# EAGLE design PowerBoard-v1.2 (EAGLE 8.5.2)
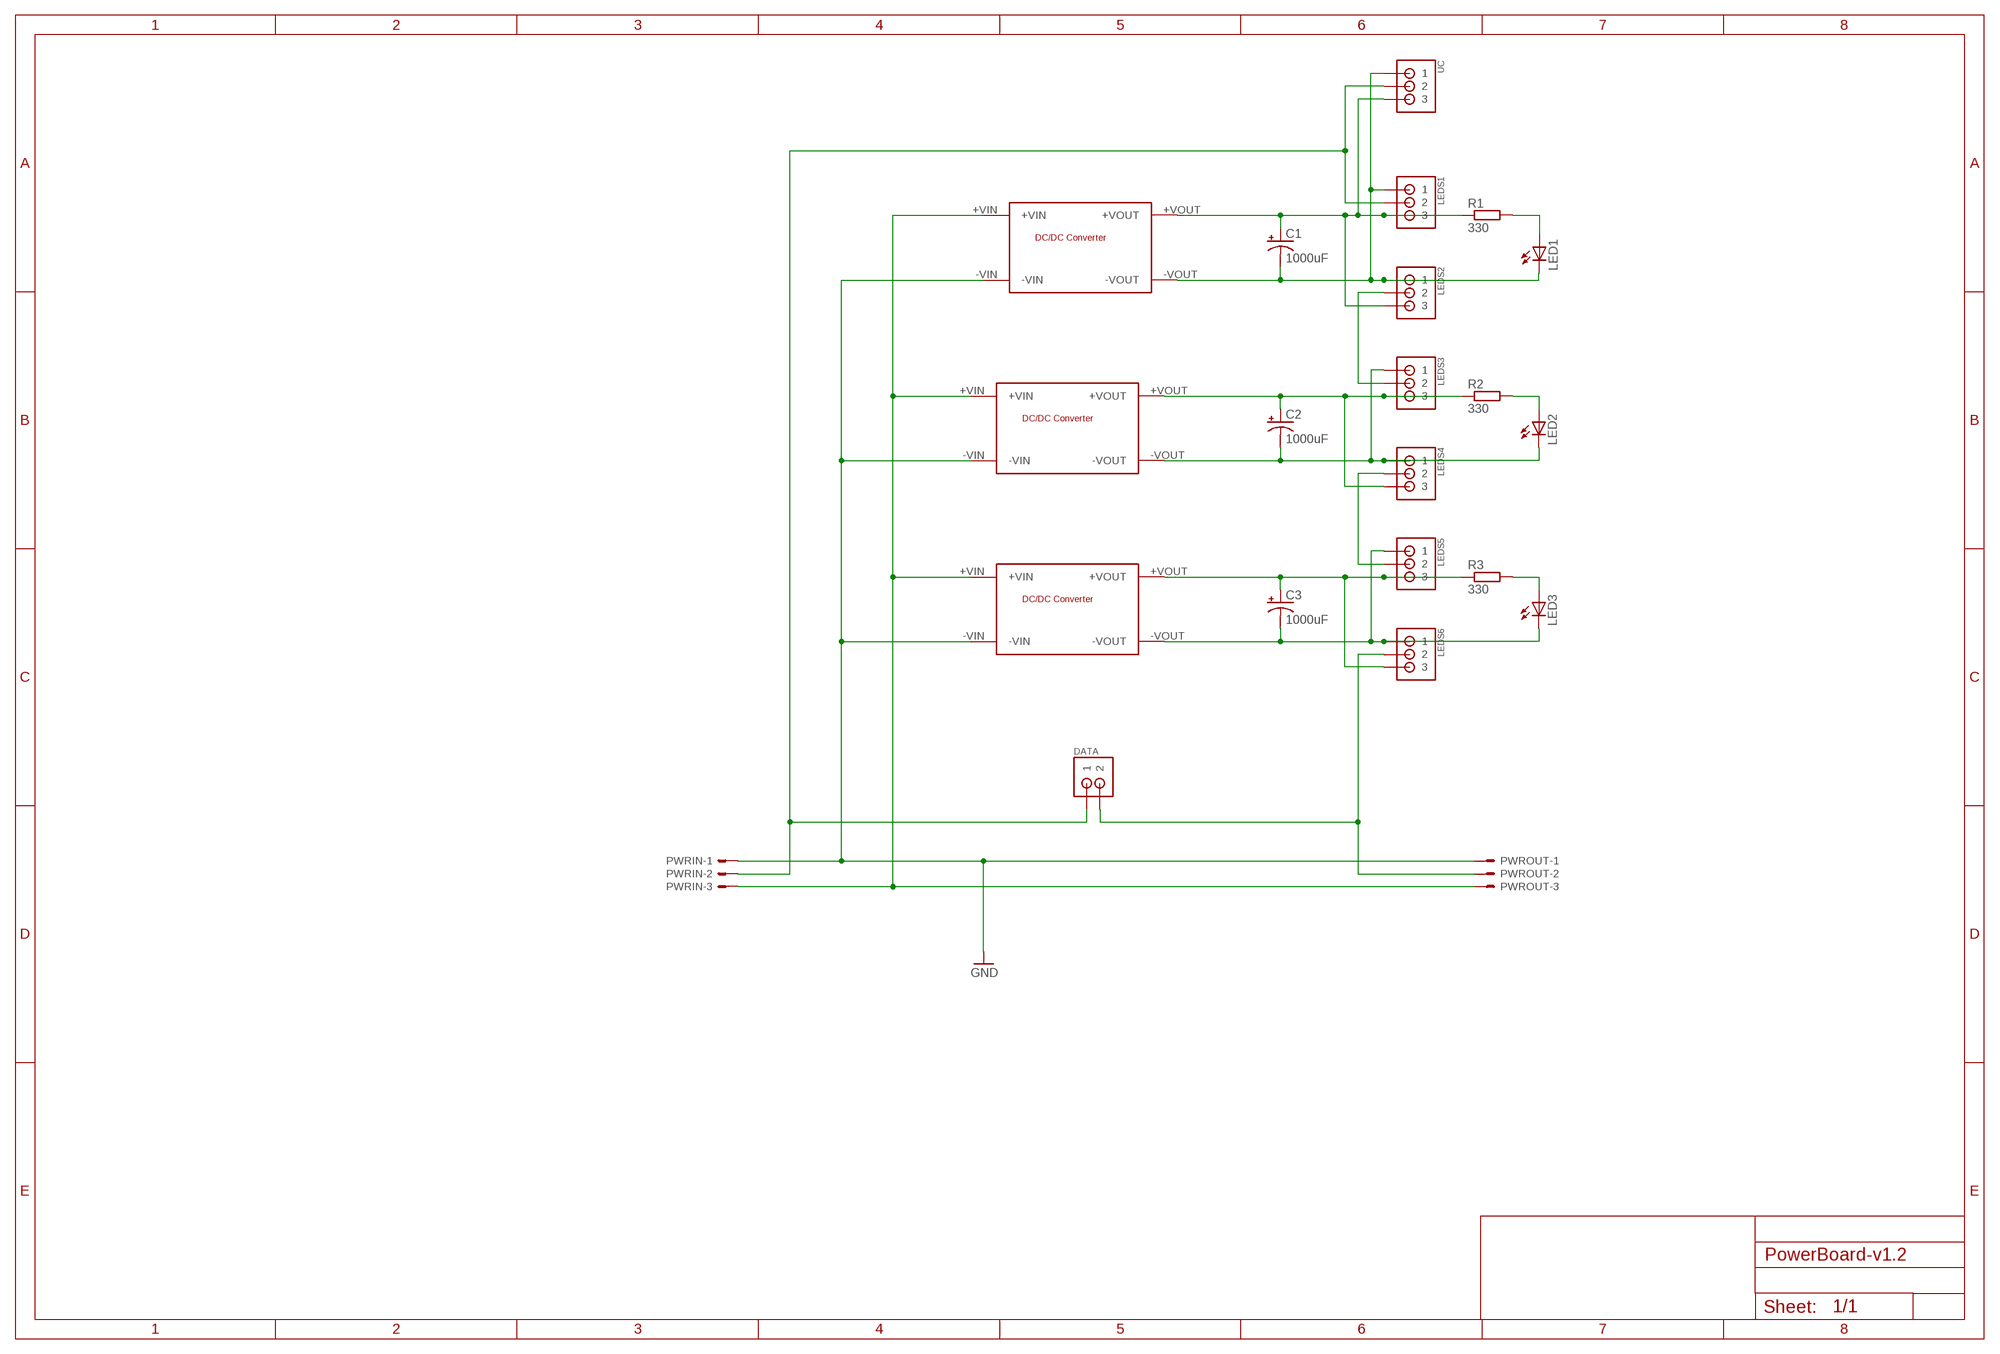
[diagram p0: schematic, sheet 1]

## Parts
C1  1000uF  CAP_POLPTH4  [CPOL-RADIAL-1000UF-25V]
C2  1000uF  CAP_POLPTH4  [CPOL-RADIAL-1000UF-25V]
C3  1000uF  CAP_POLPTH4  [CPOL-RADIAL-1000UF-25V]
DATA  JST-XA-02-PIN  [JST-XA-02]
LED1  LEDCHIP-LED0805  [CHIP-LED0805]
LED2  LEDCHIP-LED0805  [CHIP-LED0805]
LED3  LEDCHIP-LED0805  [CHIP-LED0805]
LEDS1  JST-XA-03-PIN  [JST-XA-03]
LEDS2  JST-XA-03-PIN  [JST-XA-03]
LEDS3  JST-XA-03-PIN  [JST-XA-03]
LEDS4  JST-XA-03-PIN  [JST-XA-03]
LEDS5  JST-XA-03-PIN  [JST-XA-03]
LEDS6  JST-XA-03-PIN  [JST-XA-03]
PWRIN  KK-156-3  [KK-156-3]
PWROUT  KK-156-3  [KK-156-3]
R1  330  RESISTORM0805  [M0805]
R2  330  RESISTORM0805  [M0805]
R3  330  RESISTORM0805  [M0805]
U$1  DC-DC-CONVERTER  [MP1584EN-BUCK-CONVERTER]
U$2  DC-DC-CONVERTER  [MP1584EN-BUCK-CONVERTER]
U$3  DC-DC-CONVERTER  [MP1584EN-BUCK-CONVERTER]
UC  JST-XA-03-PIN  [JST-XA-03]

## Nets
DATIN: DATA.1 LEDS1.2 PWRIN.2 UC.2
DATOUT: DATA.2 LEDS6.2 PWROUT.2
GND: PWRIN.1 PWROUT.1 U$1.-VIN U$2.-VIN U$3.-VIN
GNDOUT1: C1.- LED1.C LEDS1.1 LEDS2.1 U$1.-VOUT UC.1
GNDOUT2: C2.- LED2.C LEDS3.1 LEDS4.1 U$2.-VOUT
GNDOUT3: C3.- LED3.C LEDS5.1 LEDS6.1 U$3.-VOUT
N$2: LED1.A R1.2
N$7: LED2.A R2.2
N$11: LEDS2.2 LEDS3.2
N$12: LEDS4.2 LEDS5.2
N$15: LED3.A R3.2
VIN: PWRIN.3 PWROUT.3 U$1.+VIN U$2.+VIN U$3.+VIN
VOUT1: C1.+ LEDS1.3 LEDS2.3 R1.1 U$1.+VOUT UC.3
VOUT2: C2.+ LEDS3.3 LEDS4.3 R2.1 U$2.+VOUT
VOUT3: C3.+ LEDS5.3 LEDS6.3 R3.1 U$3.+VOUT

## Library data of the parts
C1-C3 = SparkFun-Capacitors:CAP_POL: Capacitor Polarized These are standard SMD and PTH capacitors. Normally 10uF, 47uF, and 100uF in electrolytic and tantalum varieties. Always verify the external diameter of the through hole cap, it varies with capacity, voltage, and manufacturer. The EIA devices should be standard.
DATA = abw:JST-XA-02-PIN: JST XA Connector 2 Pin Wire to board connector. Pitch: 2.54 mm, (0.100") Number of pins: 2
LED1-LED3 = adafruit:LED: LED OSRAM: - CHIPLED LG R971, LG N971, LY N971, LG Q971, LY Q971, LO R971, LY R971 LH N974, LH R974 LS Q976, LO Q976, LY Q976 LO Q996 - Hyper CHIPLED LW Q18S LB Q993, LB Q99A, LB R99A - SideLED LS A670, LO A670, LY A670, LG A670, LP A670 LB A673, LV A673, LT A673, LW A673 LH A674 LY A675 LS A676, LA A676, LO A676, LY A676, LW A676 LS A679, LY A679, LG A679 - Hyper Micro SIDELED® LS Y876, LA Y876, LO Y876, LY Y876 LT Y87S - SmartLED LW L88C, LW L88S LB L89C, LB L89S, LG L890 LS L89K, LO L89K, LY L89K LS L896, LA L896, LO L896, LY L896 - TOPLED LS T670, LO T670, LY T670, LG T670, LP T670 LSG T670, LSP T670, LSY T670, LOP T670, LYG T670 LG T671, LOG T671, LSG T671 LB T673, LV T673, LT T673, LW T673 LH T674 LS T676, LA T676, LO T676, LY T676, LB T676, LH T676, LSB T676, LW T676 LB T67C, LV T67C, LT T67C, LS T67K, LO T67K, LY T67K, LW E67C LS E67B, LA E67B, LO E67B, LY E67B, LB E67C, LV E67C, LT E67C LW T67C LS T679, LY T679, LG T679 LS T770, LO T770, LY T770, LG T770, LP T770 LB T773, LV T773, LT T773, LW T773 LH T774 LS E675, LA E675, LY E675, LS T675 LS T776, LA T776, LO T776, LY T776, LB T776 LHGB T686 LT T68C, LB T68C - Hyper Mini TOPLED® LB M676 - Mini TOPLED Santana® LG M470 LS M47K, LO M47K, LY M47K Source: http://www.osram.convergy.de/
LEDS1-LEDS6 UC = abw:JST-XA-03-PIN: JST XA Connector 3 Pin Wire to board connector. Pitch: 2.54 mm, (0.100") Number of pins: 3
PWRIN PWROUT = con-molex:KK-156-3: KK 156 HEADER Source: http://www.molex.com/pdm_docs/sd/026604100_sd.pdf; MF: MOLEX; OC_FARNELL: unknown; OC_NEWARK: unknown
R1-R3 = abw:RESISTOR: RESISTOR, European symbol
U$1-U$3 = abw:DC-DC-CONVERTER

## Board
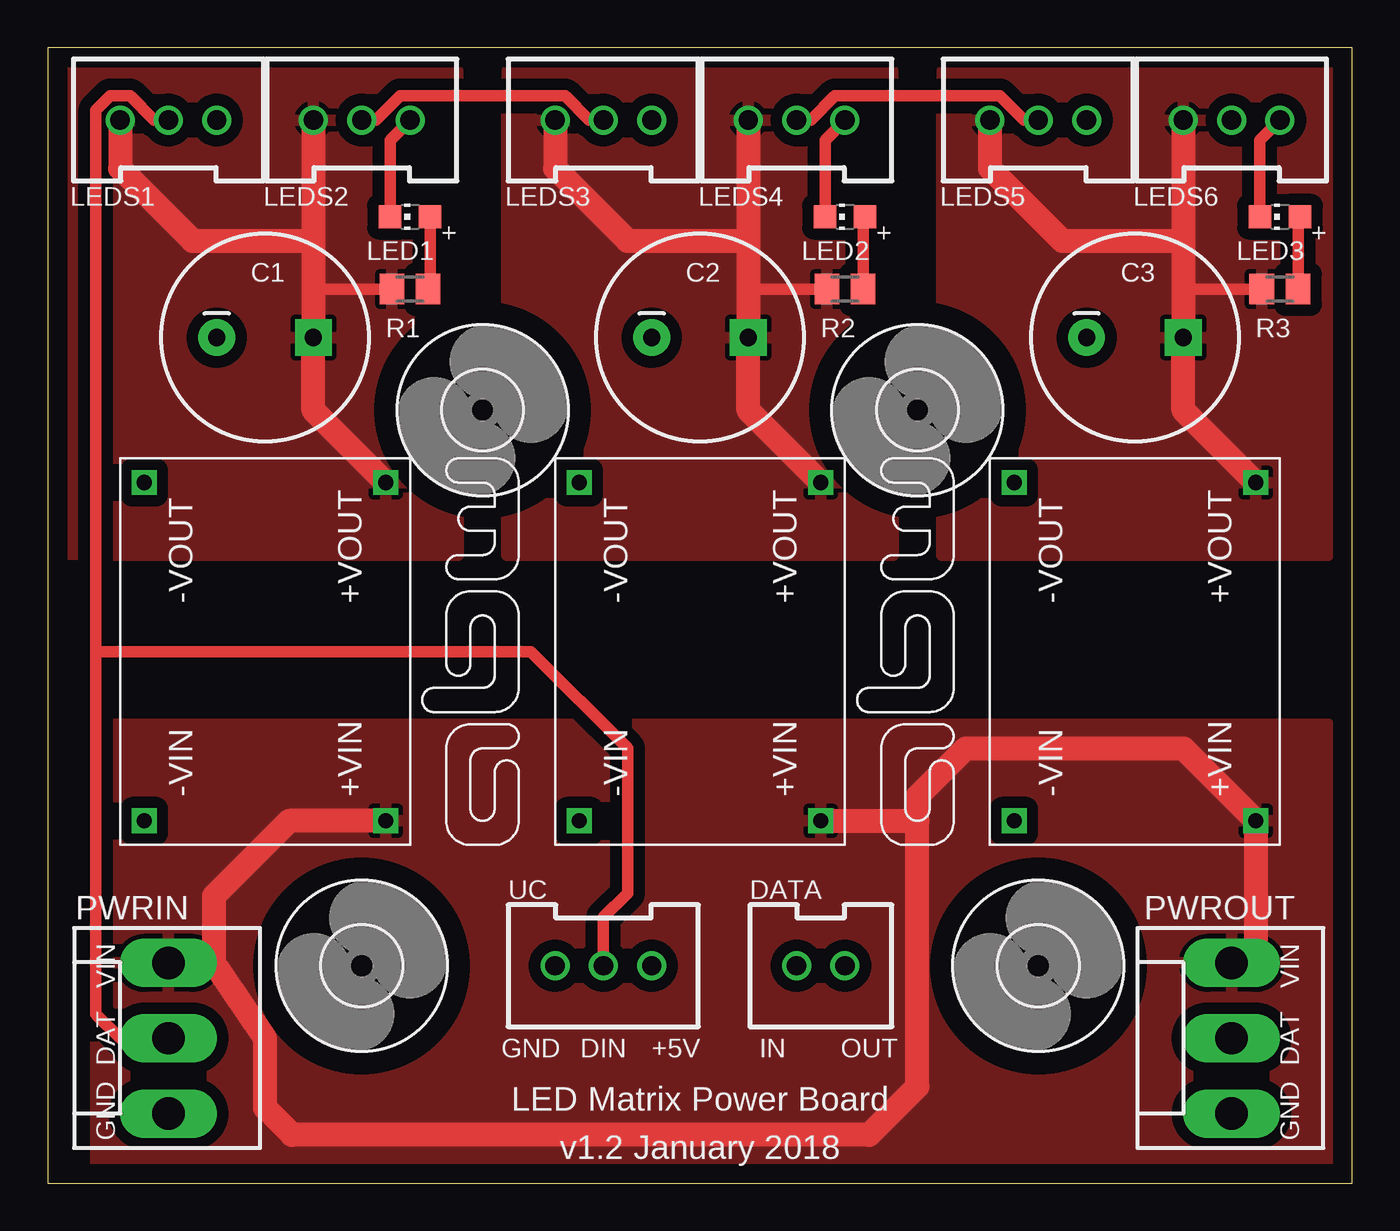
[diagram p1: board, top side]
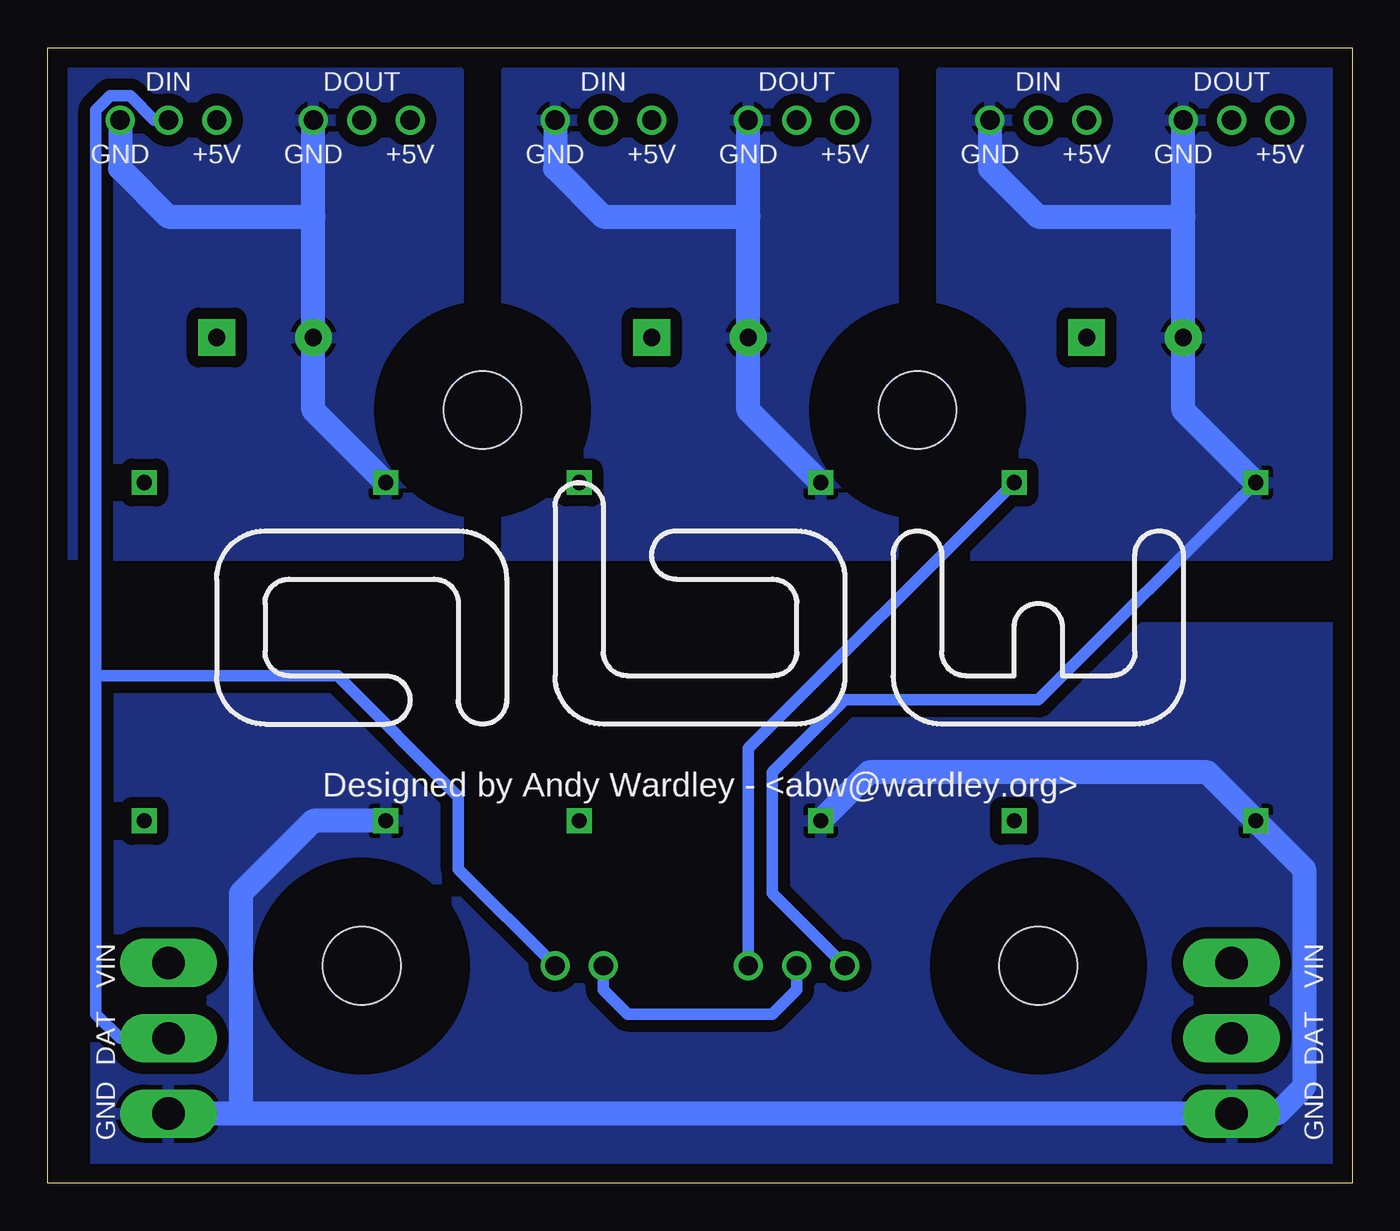
[diagram p2: board, bottom side, seen from below]

Size 68.58 x 59.69 mm. Coordinates in mm from the lower left corner, seen from the top.
Outline: 0,0 68.58,0 68.58,59.69 0,59.68 0,0
Copper layers (1*16): Top 0.035mm / dielectric 1.5mm / Bottom 0.035mm
Design rules "default": minimum track width 10mil, minimum drill 24mil, track to track 8mil, track to pad 8mil, pad to pad 8mil, via to via 8mil, smd to smd 8mil, copper to edge 40mil, drill to drill 8mil, minimum pad ring 10mil, minimum via ring 8mil, stop-mask expansion 4mil, vias tented up to drill 0mil, thermal gap 10mil

### Footprints (pad centres in the part's own frame; a part is rotated, then mirrored left to right if it is on the bottom)
CPOL-RADIAL-1000UF-25V = drill 0.9 pad 1.93 square: + 2.54,0 | drill 0.9 pad 1.93: - -2.54,0
JST-XA-02 = drill 1.016: 1 -2.54,0; 2 0,0
CHIP-LED0805 = smd 1.2 x 1.2: A 0,-1.05; C 0,1.05
JST-XA-03 = drill 1.016: 1 -2.54,0; 2 0,0; 3 2.54,0
KK-156-3 = drill 1.7 pad 2.184 long: 1 -3.96,0; 2 0,0; 3 3.96,0
M0805 = smd 1.3 x 1.6: 1 -0.95,0; 2 0.95,0
MP1584EN-BUCK-CONVERTER = drill 0.8 square: +VIN 0,0; +VOUT 17.78,0; -VIN 0,12.7; -VOUT 17.78,12.7
4,1 = hole 4.1: 0,0

### Placement (x,y rotation side)
C1  11.43,44.45 0 top
C2  34.29,44.45 0 top
C3  57.15,44.45 0 top
DATA  41.91,11.43 0 top
LED1  19.05,50.8 90 top
LED2  41.91,50.8 90 top
LED3  64.77,50.8 90 top
LEDS1  6.35,55.88 180 top
LEDS2  16.51,55.88 180 top
LEDS3  29.21,55.88 180 top
LEDS4  39.37,55.88 180 top
LEDS5  52.07,55.88 180 top
LEDS6  62.23,55.88 180 top
PWRIN  6.35,7.62 90 top
PWROUT  62.23,7.62 90 top
R1  19.05,46.99 0 top
R2  41.91,46.99 0 top
R3  64.77,46.99 0 top
U$1  17.78,19.05 90 top
U$2  40.64,19.05 90 top
U$3  63.5,19.05 90 top
U$4  [4,1]  16.51,11.43 0 top
U$5  [4,1]  22.86,40.64 0 top
U$6  [4,1]  52.07,11.43 0 top
U$7  [4,1]  45.72,40.64 0 top
U$8  [ABWLOGO-SMALL]  34.29,29.21 0 bottom
U$9  [ABWLOGO-MICRO]  22.86,27.94 90 top
U$10  [ABWLOGO-MICRO]  45.72,27.94 90 top
UC  29.21,11.43 0 top

### Tracks (layer width: path | path; a pad name or v marks a point on that pad's centre or on a via)
DATIN
  Top 0.61: LEDS1.2 5.61,55.88 4.34,57.15 3.28,57.15 2.54,56.41 2.54,27.94 | 2.54,27.94 2.54,8.89 3.81,7.62 PWRIN.2 | UC.2 29.21,13.97 30.48,15.24 30.48,22.86 25.4,27.94 2.54,27.94
  Bottom 0.61: DATA.1 39.37,10.16 38.1,8.89 30.48,8.89 29.21,10.16 UC.2
DATOUT
  Bottom 0.61: LEDS6.2 62.97,55.88 64.24,57.15 65.3,57.15 66.04,56.41 66.04,26.67 | 66.04,26.67 66.04,8.89 64.77,7.62 PWROUT.2 | DATA.2 46.99,16.51 46.99,20.32 53.34,26.67 66.04,26.67
GND
  Bottom 1.27: U$2.-VIN 25.4,21.59 7.62,21.59 U$1.-VIN 2.54,16.51 2.54,5.08 3.96,3.66 PWRIN.1 58.42,3.66 | U$3.-VIN 54.61,19.05 58.42,15.24 58.42,3.66 | 58.42,3.66 PWROUT.1
  pour Bottom (isolate 0.61): 0,29.21 66.04,29.21 66.04,0 0,0
GNDOUT1
  Top 0.61: LED1.C 18,54.83 LEDS2.1
  Bottom 0.61: U$1.-VOUT 16.51,25.4 26.67,25.4 30.48,21.59 30.48,15.24 UC.1
  Bottom 1.27: 8.89,50.8 C1.- 8.89,40.64 U$1.-VOUT | 8.89,50.8 LEDS1.1 | LEDS2.1 19.05,53.34 16.51,50.8 8.89,50.8
  pour Bottom (isolate 0.61): 1.27,58.42 21.59,58.42 21.59,33.02 1.27,33.02
GNDOUT2
  Top 0.61: LED2.C 40.86,54.83 LEDS4.1
  Bottom 1.27: 31.75,50.8 C2.- 31.75,40.64 U$2.-VOUT | 31.75,50.8 LEDS3.1 | LEDS4.1 41.91,53.34 39.37,50.8 31.75,50.8
  pour Bottom (isolate 0.61): 24.13,58.42 44.45,58.42 44.45,33.02 24.13,33.02
GNDOUT3
  Top 0.61: LED3.C 63.72,54.83 LEDS6.1
  Bottom 1.27: 54.61,50.8 C3.- 54.61,40.64 U$3.-VOUT | 54.61,50.8 LEDS5.1 | LEDS6.1 64.77,53.34 62.23,50.8 54.61,50.8
  pour Bottom (isolate 0.61): 46.99,58.42 67.31,58.42 67.31,33.02 46.99,33.02
N$2
  Top 0.61: R1.2 20.1,47.09 LED1.A
N$7
  Top 0.61: R2.2 42.86,50.7 LED2.A
N$11
  Top 0.61: LEDS2.2 17.25,55.88 18.52,57.15 27.2,57.15 28.47,55.88 LEDS3.2
N$12
  Top 0.61: LEDS4.2 40.11,55.88 41.38,57.15 50.06,57.15 51.33,55.88 LEDS5.2
N$15
  Top 0.61: R3.2 65.72,50.7 LED3.A
VIN
  Top 1.27: U$1.+VIN 12.7,19.05 8.74,15.09 8.74,11.58 | 45.72,19.05 45.72,5.08 43.18,2.54 12.85,2.54 11.43,3.96 11.43,7.62 8.74,11.58 | 45.72,19.05 45.72,20.32 48.26,22.86 59.69,22.86 U$3.+VIN 63.5,11.58 PWROUT.3 | U$2.+VIN 45.72,19.05 | 8.74,11.58 PWRIN.3
  pour Top (isolate 0.61): 2.54,0 2.54,24.13 67.31,24.13 67.31,0
VOUT1
  Top 0.61: R1.1 13.97,46.99
  Top 1.27: LEDS2.3 13.97,49.53 | 13.97,49.53 13.97,46.99 C1.+ 13.97,40.64 U$1.+VOUT | LEDS1.3 3.81,53.34 7.62,49.53 13.97,49.53
  Bottom 0.61: U$1.+VOUT 31.75,22.86 UC.3
  pour Top (isolate 0.61): 1.27,58.42 21.59,58.42 21.59,33.02 1.27,33.02
VOUT2
  Top 0.61: R2.1 36.83,46.99
  Top 1.27: LEDS4.3 36.83,49.53 | 36.83,49.53 36.83,46.99 C2.+ 36.83,40.64 U$2.+VOUT | LEDS3.3 26.67,53.34 30.48,49.53 36.83,49.53
  pour Top (isolate 0.61): 24.13,58.42 44.45,58.42 44.45,33.02 24.13,33.02
VOUT3
  Top 0.61: R3.1 59.69,46.99
  Top 1.27: LEDS6.3 59.69,49.53 | 59.69,49.53 59.69,46.99 C3.+ 59.69,40.64 U$3.+VOUT | LEDS5.3 49.53,53.34 53.34,49.53 59.69,49.53
  pour Top (isolate 0.61): 46.99,58.42 67.31,58.42 67.31,33.02 46.99,33.02

### Text on the board
tPlace: v1.2 January 2018
tNames: VIN | VIN | DAT | GND | DIN | +5V | IN | OUT | DAT | GND | LED Matrix Power Board | GND
bNames: DOUT | DIN | DOUT | DIN | DOUT | DIN | +5V | GND | +5V | GND | +5V | GND | +5V | GND | +5V | GND | +5V | GND | VIN | VIN | DAT | DAT | GND | GND